# EAGLE design BinaryClockDisplay (EAGLE 9.3.2)
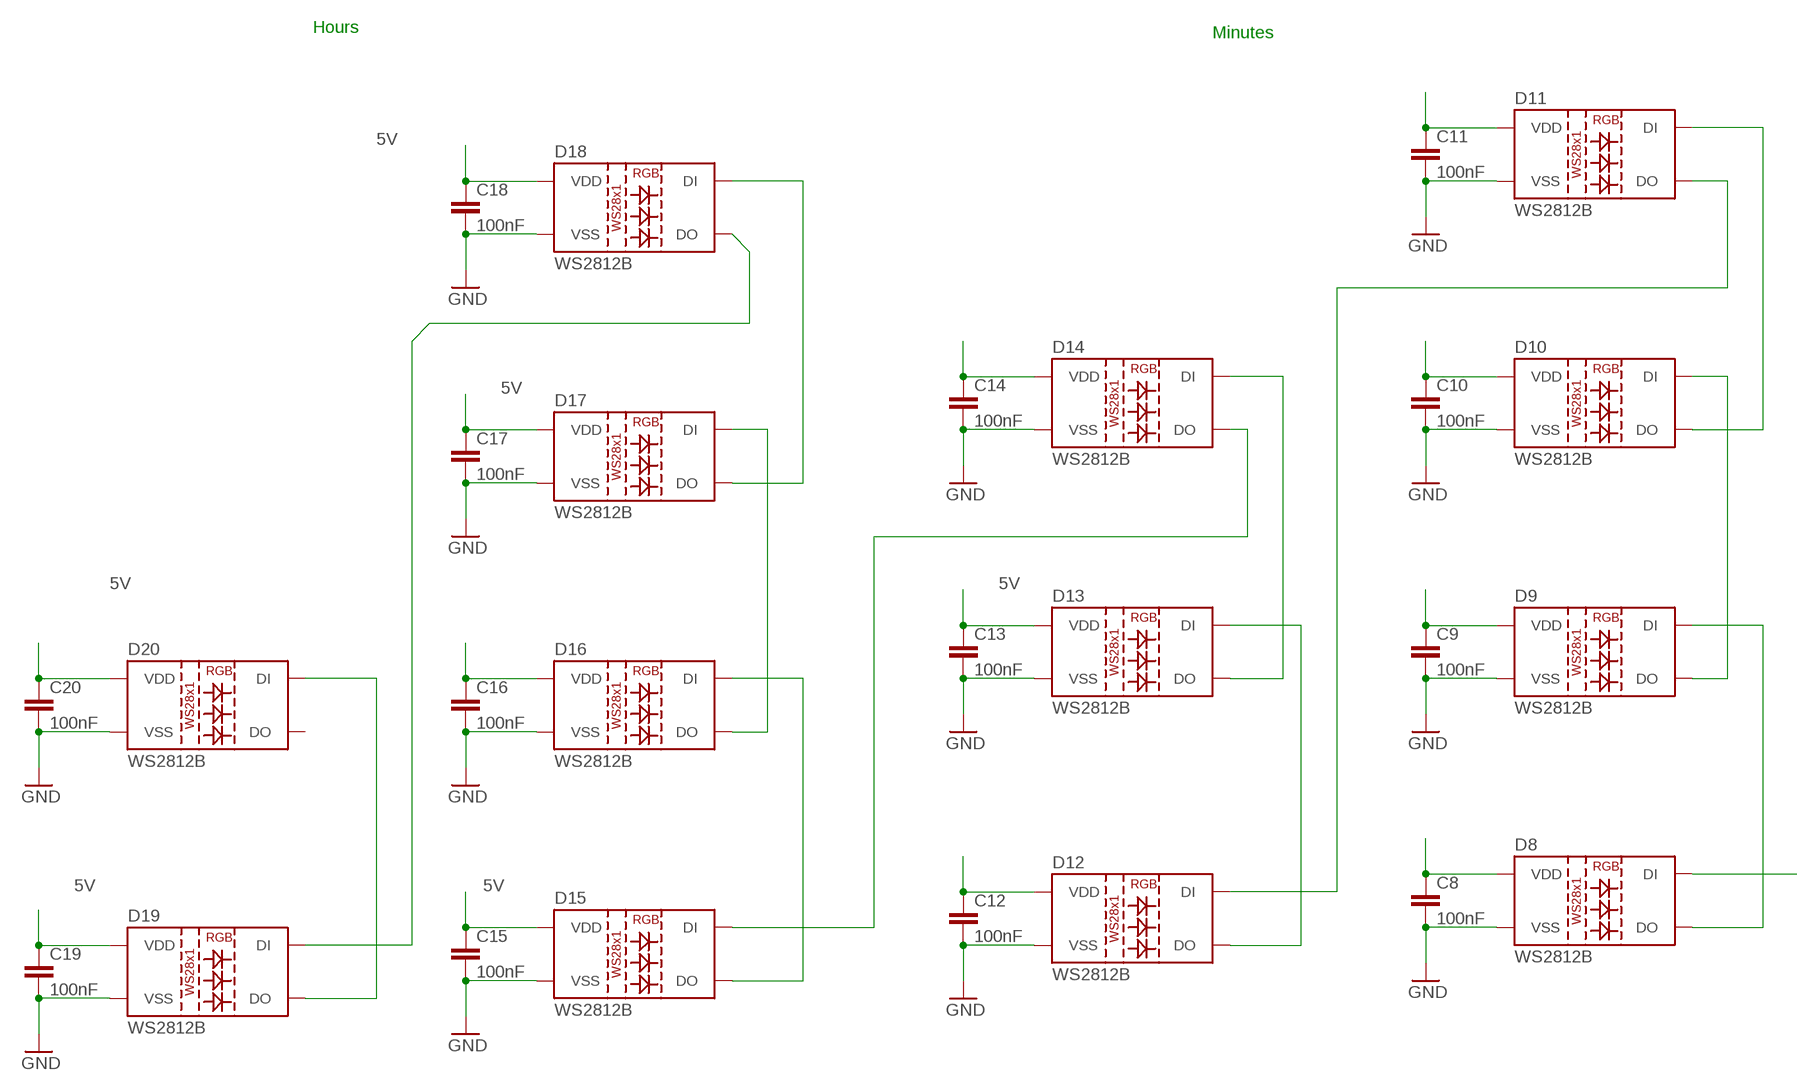
[diagram p0: schematic, sheet 1, part 1 of 2]
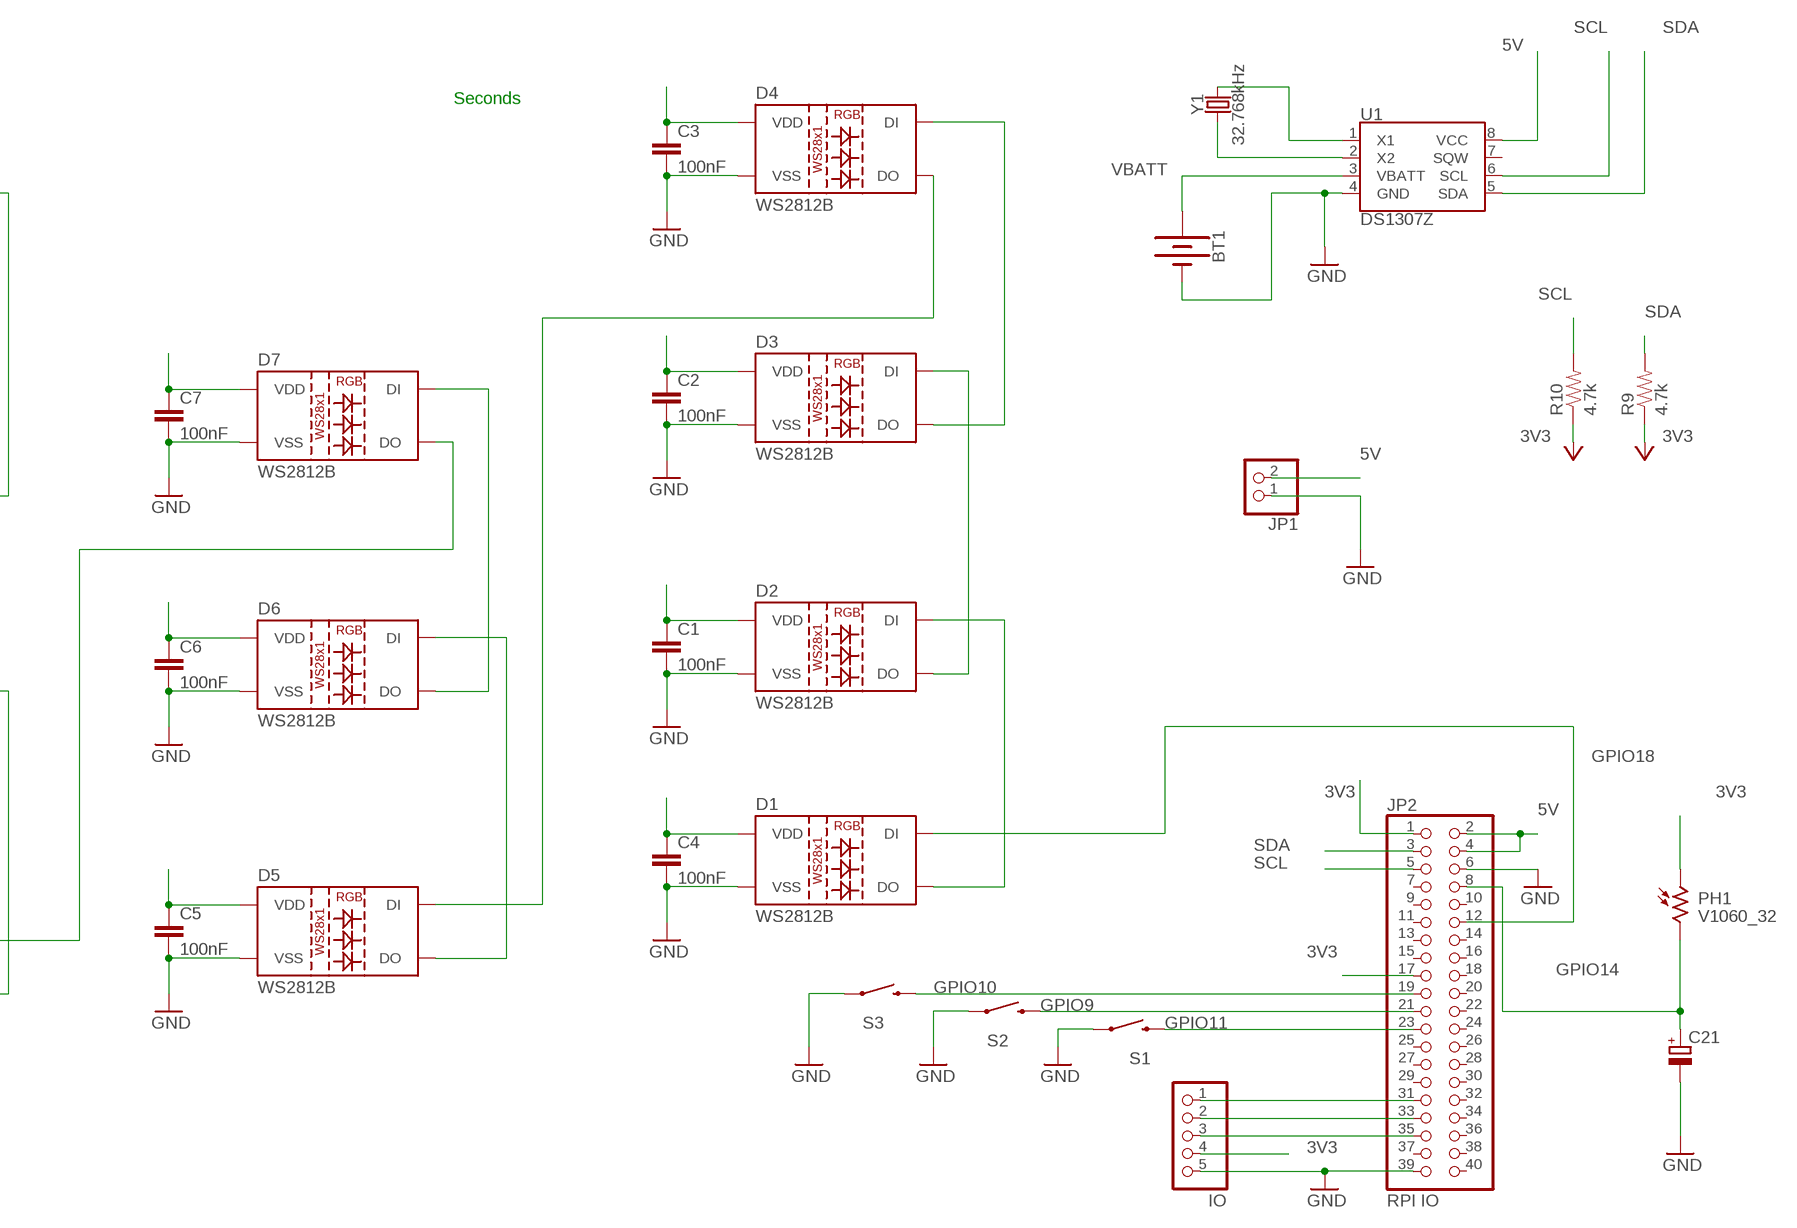
[diagram p1: schematic, sheet 1, part 2 of 2]

## Parts
BT1  BATTERY-20MM_PTH  [BATTCOM_20MM_PTH]
C1  100nF  CAP0805  [0805]
C2  100nF  CAP0805  [0805]
C3  100nF  CAP0805  [0805]
C4  100nF  CAP0805  [0805]
C5  100nF  CAP0805  [0805]
C6  100nF  CAP0805  [0805]
C7  100nF  CAP0805  [0805]
C8  100nF  CAP0805  [0805]
C9  100nF  CAP0805  [0805]
C10  100nF  CAP0805  [0805]
C11  100nF  CAP0805  [0805]
C12  100nF  CAP0805  [0805]
C13  100nF  CAP0805  [0805]
C14  100nF  CAP0805  [0805]
C15  100nF  CAP0805  [0805]
C16  100nF  CAP0805  [0805]
C17  100nF  CAP0805  [0805]
C18  100nF  CAP0805  [0805]
C19  100nF  CAP0805  [0805]
C20  100nF  CAP0805  [0805]
C21  CPOL-EUE5-10.5  [E5-10,5]
D1  WS2812B  [WS2812B]
D2  WS2812B  [WS2812B]
D3  WS2812B  [WS2812B]
D4  WS2812B  [WS2812B]
D5  WS2812B  [WS2812B]
D6  WS2812B  [WS2812B]
D7  WS2812B  [WS2812B]
D8  WS2812B  [WS2812B]
D9  WS2812B  [WS2812B]
D10  WS2812B  [WS2812B]
D11  WS2812B  [WS2812B]
D12  WS2812B  [WS2812B]
D13  WS2812B  [WS2812B]
D14  WS2812B  [WS2812B]
D15  WS2812B  [WS2812B]
D16  WS2812B  [WS2812B]
D17  WS2812B  [WS2812B]
D18  WS2812B  [WS2812B]
D19  WS2812B  [WS2812B]
D20  WS2812B  [WS2812B]
JP1  PINHD-1X2  [1X02]
JP2  RPI IO  PINHD-2X20  [2X20]
JP4  IO  PINHD-1X5  [1X05]
PH1  V1060_32  [TO-5_V10]
R9  4.7k  RESISTOR0805-RES  [0805]
R10  4.7k  RESISTOR0805-RES  [0805]
S1  SWITCH  SWITCH-MOMENTARY-2SMD-1101NE  [TACTILE-SWITCH-1101NE]
S2  SWITCH  SWITCH-MOMENTARY-2SMD-1101NE  [TACTILE-SWITCH-1101NE]
S3  SWITCH  SWITCH-MOMENTARY-2SMD-1101NE  [TACTILE-SWITCH-1101NE]
U1  DS1307Z  [SO08-0.15]
Y1  32.768kHz  CRYSTAL-32.768KHZPTH-2X6  [CRYSTAL-PTH-2X6-CYL]

## Nets
3V3: JP2.1 JP2.17 JP4.4 PH1.1 R9.1 R10.1 ; supply symbol labelled +3V3
5V: C1.1 C2.1 C3.1 C4.1 C5.1 C6.1 C7.1 C8.1 C9.1 C10.1 C11.1 C12.1 C13.1 C14.1 C15.1 C16.1 C17.1 C18.1 C19.1 C20.1 D1.1(VDD) D2.1(VDD) D3.1(VDD) D4.1(VDD) D5.1(VDD) D6.1(VDD) D7.1(VDD) D8.1(VDD) D9.1(VDD) D10.1(VDD) D11.1(VDD) D12.1(VDD) D13.1(VDD) D14.1(VDD) D15.1(VDD) D16.1(VDD) D17.1(VDD) D18.1(VDD) D19.1(VDD) D20.1(VDD) JP1.2 JP2.2 JP2.4 U1.8(VCC)
GND: BT1.2(-) C1.2 C2.2 C3.2 C4.2 C5.2 C6.2 C7.2 C8.2 C9.2 C10.2 C11.2 C12.2 C13.2 C14.2 C15.2 C16.2 C17.2 C18.2 C19.2 C20.2 C21.- D1.3(VSS) D2.3(VSS) D3.3(VSS) D4.3(VSS) D5.3(VSS) D6.3(VSS) D7.3(VSS) D8.3(VSS) D9.3(VSS) D10.3(VSS) D11.3(VSS) D12.3(VSS) D13.3(VSS) D14.3(VSS) D15.3(VSS) D16.3(VSS) D17.3(VSS) D18.3(VSS) D19.3(VSS) D20.3(VSS) JP1.1 JP2.6 JP2.39 JP4.5 S1.1 S2.1 S3.1 U1.4(GND)
GPIO6: JP2.31 JP4.1
GPIO9: JP2.21 S2.2
GPIO10: JP2.19 S3.2
GPIO11: JP2.23 S1.2
GPIO13: JP2.33 JP4.2
GPIO14: C21.+ JP2.8 PH1.2
GPIO18: D1.4(DI) JP2.12
GPIO19: JP2.35 JP4.3
N$1: D4.2(DO) D5.4(DI)
N$5: D5.2(DO) D6.4(DI)
N$6: D1.2(DO) D2.4(DI)
N$7: D2.2(DO) D3.4(DI)
N$8: D3.2(DO) D4.4(DI)
N$9: U1.1(X1) Y1.2
N$10: D6.2(DO) D7.4(DI)
N$11: D8.2(DO) D9.4(DI)
N$12: D9.2(DO) D10.4(DI)
N$13: D10.2(DO) D11.4(DI)
N$14: D11.2(DO) D12.4(DI)
N$15: D7.2(DO) D8.4(DI)
N$16: D12.2(DO) D13.4(DI)
N$17: D13.2(DO) D14.4(DI)
N$18: D15.2(DO) D16.4(DI)
N$19: D16.2(DO) D17.4(DI)
N$20: D17.2(DO) D18.4(DI)
N$21: D14.2(DO) D15.4(DI)
N$22: U1.2(X2) Y1.1
N$23: D19.2(DO) D20.4(DI)
N$26: D18.2(DO) D19.4(DI)
SCL: JP2.5 R10.2 U1.6(SCL)
SDA: JP2.3 R9.2 U1.5(SDA)
VBATT: BT1.1(+) U1.3(VBATT)
Unconnected: D20.2(DO) JP2.7 JP2.9 JP2.10 JP2.11 JP2.13 JP2.14 JP2.15 JP2.16 JP2.18 JP2.20 JP2.22 JP2.24 JP2.25 JP2.26 JP2.27 JP2.28 JP2.29 JP2.30 JP2.32 JP2.34 JP2.36 JP2.37 JP2.38 JP2.40 U1.7(SQW)

## Notes on the sheet
- Hours
- Minutes | Seconds

## Library data of the parts
BT1 = SparkFun-Batteries:BATTERY: Battery - Single Cell A variety of battery chemistries, sizes, and footprints. Device List: 20MM_PTH - Coin Cell Battery Holder - 20mm (PTH) <https://www.sparkfun.com/products/783> 6.8MM_PTH - Coin Cell Battery Holder - 6.8MM(SMD) <https://www.digikey.com/product-detail/en/seiko-instruments/MS621FE-FL11E/728-1057-ND/1889208?WT.srch=1&gclid=CNOQ5a6LzdQCFZS2wAodXCkE0g> 12MM_SMD - Coin Cell Battery Holder - 12mm (SMD) <https://www.sparkfun.com/products/10592> 12MM_PTH - Coin Cell Battery Holder - 12mm (PTH) <https://www.sparkfun.com/products/7948> 20MM_SMD - 20mm Coin Cell Battery Holder (SMD) (2 legs) Used on the Big Time Watch Kit <https://www.sparkfun.com/products/11734> 20MM_SMD_4LEGS - Coin Cell Battery Holder - 20mm (SMD) <https://www.sparkfun.com/products/11892> 20MM_SMD_4LEGS_OVERPASTE - Coin Cell Battery Holder - 20mm (SMD) <https://www.sparkfun.com/products/11892> (Over-paste on the legs) 24.5MM_PTH - Coin Cell Battery Holder - 24.5mm (PTH) <https://www.sparkfun.com/products/8863> 9V - 9V Battery Holder - PC Mount Used on the SparkFun SparkPunk Sound Kit <https://www.sparkfun.com/products/11177> and SparkFun SparkPunk Sequencer Kit <https://www.sparkfun.com/products/12707> 18650 - Battery Holder - 18650 (PTH) <https://www.sparkfun.com/products/13113> AA - Battery Holder - 1xAA (PTH) <https://www.sparkfun.com/products/7949> AAA - Battery Holder - 1xAAA (PTH) <https://www.sparkfun.com/products/12718> AA_KIT - Battery Holder - 1xAA (PTH) <https://www.sparkfun.com/products/7949> Special kit package - pads only have exposed copper on one side of the board. AAA_KIT - Battery Holder - 1xAAA (PTH) <https://www.sparkfun.com/products/12718> Special kit package - pads only have exposed copper on one side of the board.; PROD_ID: BATT-09031; SF_SKU: PRT-00783
C1-C20 = SparkFun-Passives:CAP: Capacitor Standard 0603 ceramic capacitor, and 0.1" leaded capacitor.
C21 = rcl:CPOL-EU: POLARIZED CAPACITOR, European symbol; SPICEPREFIX: C
D1-D20 = SparkFun-LED:WS2812B: WS2812B SMD addressable RGB LED 5x5mm SMD LED with built-in controller IC. Color: Red/Green/Blue mC Rating: RGB: 390, 660, 180 mcd Forward Voltage: RGB: 2.0, 3.0, 3.0 V Packages:WS2812B SparkFun Products: Blynk Board - ESP8266 <https://www.sparkfun.com/products/13794>; PROD_ID: DIO-12503
JP1 = pinhead:PINHD-1X2: PIN HEADER
JP2 = pinhead:PINHD-2X20: PIN HEADER
JP4 = pinhead:PINHD-1X5: PIN HEADER
PH1 = photo-elements:?1060*: Sensor Street Light control Source: http://optoelectronics.perkinelmer.com/content/Datasheets/DTS_PhotocellsB1060.pdf
R9 R10 = SparkFun-Resistors:RESISTOR: Resistor Basic schematic elements and footprints for 0603, 1206, and PTH resistors.
S1-S3 = SparkFun-Electromechanical:SWITCH-MOMENTARY-2: Various NO switches- pushbuttons, reed, etc; PROD_ID: SWCH-00815
U1 = SparkFun-Clocks:DS1307: Maxim DS1307 - I2C Real-time clock (RTC) The DS1307 serial real-time clock (RTC) is a low-power, full binary-coded decimal (BCD) clock/calendar plus 56 bytes of NV SRAM. Address and data are transferred serially through an I2C, bidirectional bus. The clock/calendar provides seconds, minutes, hours, day, date, month, and year information. SparkFun Products: Real Time Clock Module <https://www.sparkfun.com/products/12708> (BOB-12708) Datasheet <https://cdn.sparkfun.com/datasheets/BreakoutBoards/DS1307.pdf>; PROD_ID: IC-08138
Y1 = SparkFun-Clocks:CRYSTAL-32.768KHZ: 32.768kHz Crystal Frequency: 32.768kHz Frequency Stability: ±20ppm Load Capacitance: 12.5pF (PTH-2X6 & SMD-3.2X1.5), 6pF (SMD-2X6) SparkFun Products: SparkFun BigTime Watch Kit <https://www.sparkfun.com/products/11734> SparkFun nRF52832 Breakout <https://www.sparkfun.com/products/13990> SparkFun Real Time Clock Module <https://www.sparkfun.com/products/12708>; PROD_ID: XTAL-10112

## Board
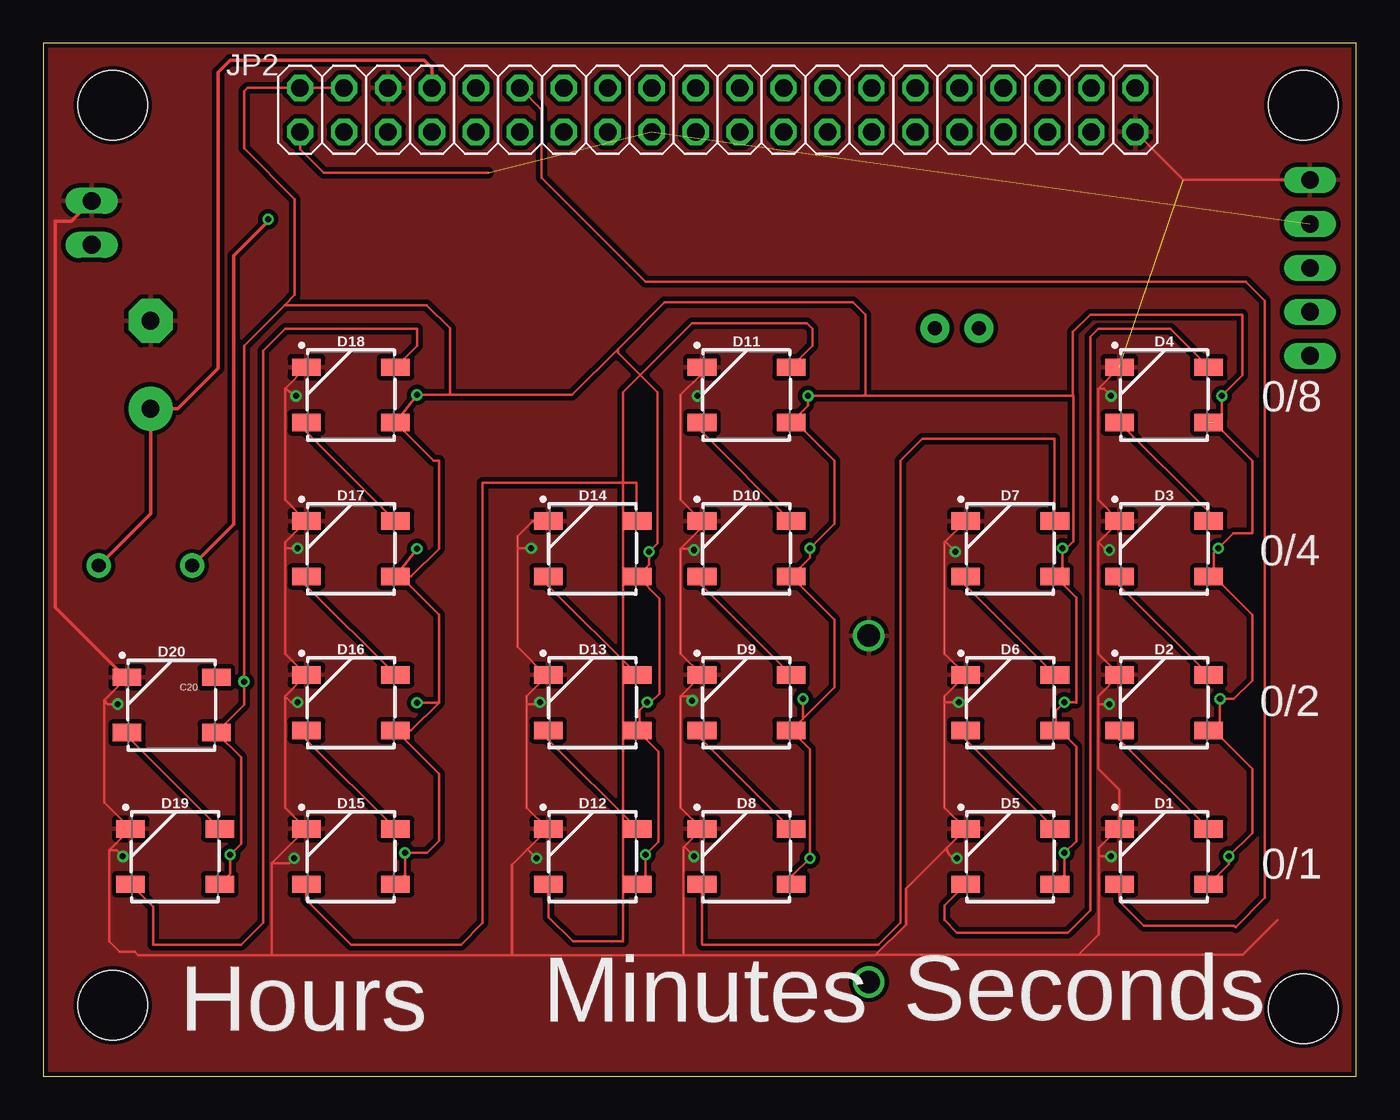
[diagram p2: board, top side]
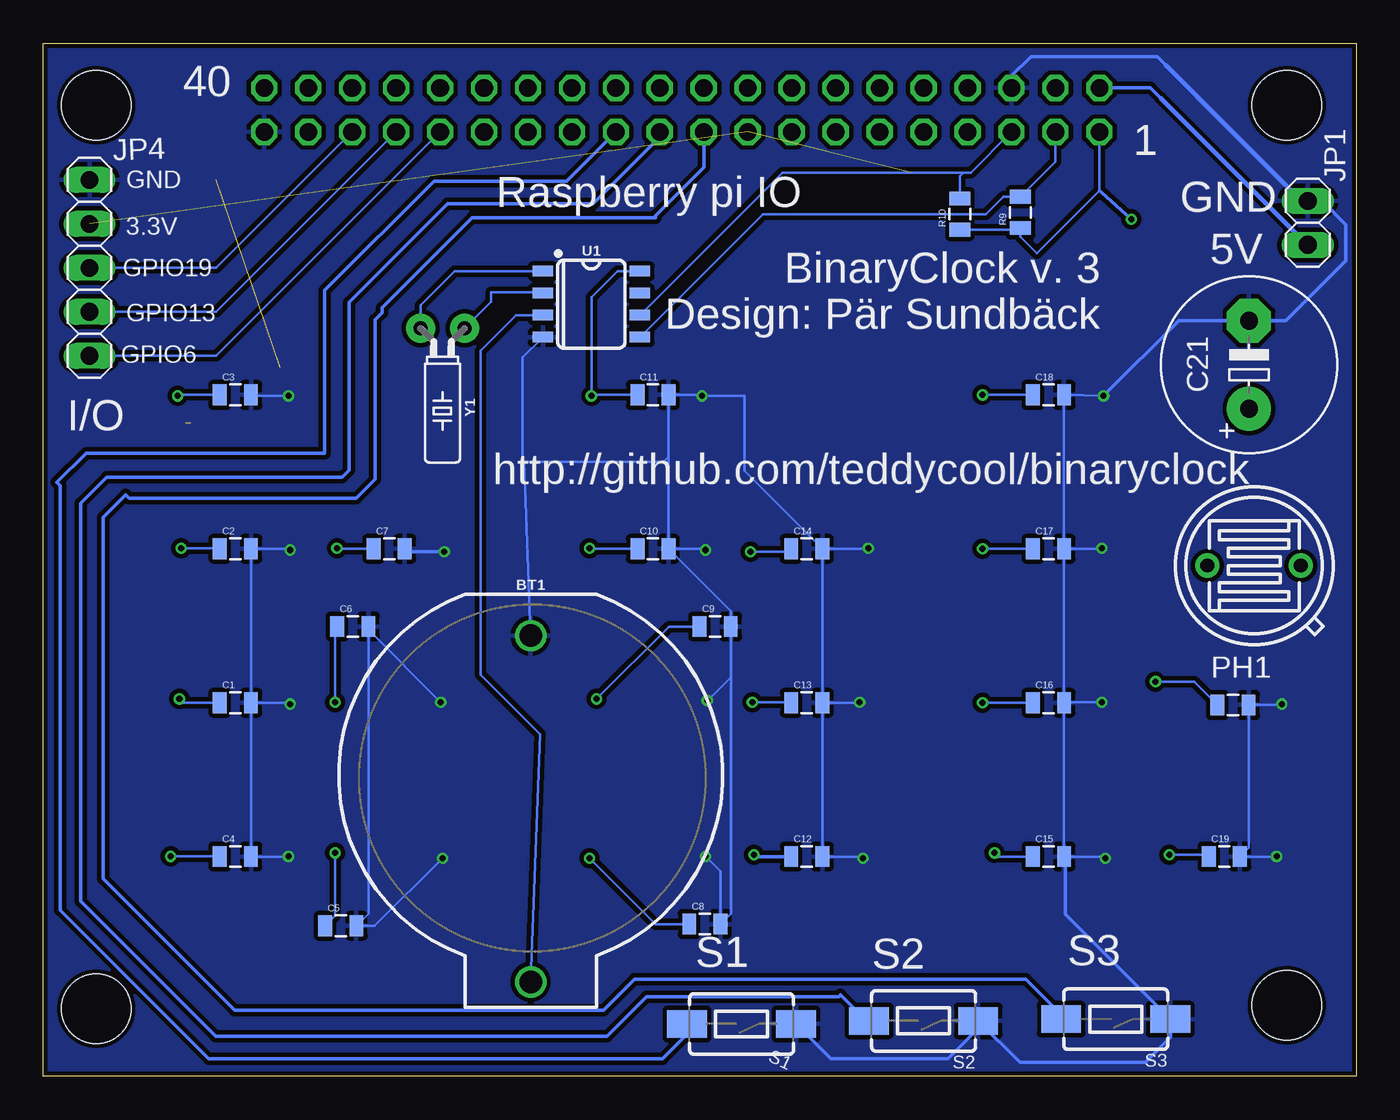
[diagram p3: board, bottom side, seen from below]

Size 75.87 x 59.68 mm. Coordinates in mm from the lower left corner, seen from the top.
Outline: 0,0 75.87,0 75.87,59.68 0,59.68 0,0
Copper layers (1*16): Top 0.035mm / dielectric 1.5mm / Bottom 0.035mm
Design rules "aisler_2_layer": minimum track width 0.1mm, minimum drill 0.2mm, track to track 0.1mm, track to pad 0.1mm, pad to pad 0.1mm, via to via 0.1mm, smd to smd 0.1mm, copper to edge 0.2mm, drill to drill 0.21mm, minimum pad ring 0.25mm, minimum via ring 0.15mm, stop-mask expansion 0mil, vias tented up to drill 0mil, thermal gap 10mil
Holes 4 mm at 4,56.11 72.8,56.11 4,4.11 72.8,3.91

### Footprints (pad centres in the part's own frame; a part is rotated, then mirrored left to right if it is on the bottom)
BATTCOM_20MM_PTH = drill 1.3: 1 11.85,0; 2 -8.15,0
0805 = smd 0.8 x 1.2: 1 -0.9,0; 2 0.9,0
E5-10,5 = drill 1.016 pad 2.54: + -2.54,0 | drill 1.016 pad 2.54 octagon: - 2.54,0
WS2812B = smd 1.651 x 1: 1 2.577,-1.6; 2 2.577,1.6; 3 -2.577,1.6; 4 -2.577,-1.6
1X02 = drill 1.016 long: 1 -1.27,0; 2 1.27,0
2X20 = drill 1.016 octagon: 1 -24.13,-1.27; 2 -24.13,1.27; 3 -21.59,-1.27; 4 -21.59,1.27; 5 -19.05,-1.27; 6 -19.05,1.27; 7 -16.51,-1.27; 8 -16.51,1.27; 9 -13.97,-1.27; 10 -13.97,1.27; 11 -11.43,-1.27; 12 -11.43,1.27; 13 -8.89,-1.27; 14 -8.89,1.27; 15 -6.35,-1.27; 16 -6.35,1.27; 17 -3.81,-1.27; 18 -3.81,1.27; 19 -1.27,-1.27; 20 -1.27,1.27; 21 1.27,-1.27; 22 1.27,1.27; 23 3.81,-1.27; 24 3.81,1.27; 25 6.35,-1.27; 26 6.35,1.27; 27 8.89,-1.27; 28 8.89,1.27; 29 11.43,-1.27; 30 11.43,1.27; 31 13.97,-1.27; 32 13.97,1.27; 33 16.51,-1.27; 34 16.51,1.27; 35 19.05,-1.27; 36 19.05,1.27; 37 21.59,-1.27; 38 21.59,1.27; 39 24.13,-1.27; 40 24.13,1.27
1X05 = drill 1.016 long: 1 -5.08,0; 2 -2.54,0; 3 0,0; 4 2.54,0; 5 5.08,0
TO-5_V10 = drill 0.8 pad 1.4: 1 -2.7,0; 2 2.7,0
TACTILE-SWITCH-1101NE = smd 2.3 x 1.6: 1 -3.15,0; 2 3.15,0
SO08-0.15 = smd 0.6 x 1.2: 1 -1.905,-2.8; 2 -0.635,-2.8; 3 0.635,-2.8; 4 1.905,-2.8; 5 1.905,2.8; 6 0.635,2.8; 7 -0.635,2.8; 8 -1.905,2.8
CRYSTAL-PTH-2X6-CYL = drill 0.813 pad 1.676: 1 -1.27,0; 2 1.27,0

### Placement (x,y rotation side)
BT1  47.7,17.31 270 bottom
C1  64.77,21.59 0 bottom
C2  64.77,30.48 0 bottom
C3  64.77,39.37 0 bottom
C4  64.77,12.7 0 bottom
C5  58.68,8.7 0 bottom
C6  57.98,25.99 0 bottom
C7  55.88,30.48 0 bottom
C8  37.64,8.8 0 bottom
C9  37.04,25.99 0 bottom
C10  40.64,30.48 0 bottom
C11  40.64,39.37 0 bottom
C12  31.75,12.7 0 bottom
C13  31.75,21.59 0 bottom
C14  31.75,30.48 0 bottom
C15  17.78,12.7 0 bottom
C16  17.78,21.59 0 bottom
C17  17.78,30.48 0 bottom
C18  17.78,39.37 0 bottom
C19  7.62,12.7 0 bottom
C20  7.12,21.46 0 bottom
C21  6.2,41.11 90 bottom
D1  64.77,12.7 0 top
D2  64.77,21.59 0 top
D3  64.77,30.48 0 top
D4  64.77,39.37 0 top
D5  55.88,12.7 0 top
D6  55.88,21.59 0 top
D7  55.88,30.48 0 top
D8  40.64,12.7 0 top
D9  40.64,21.59 0 top
D10  40.64,30.48 0 top
D11  40.64,39.37 0 top
D12  31.75,12.7 0 top
D13  31.75,21.59 0 top
D14  31.75,30.48 0 top
D15  17.78,12.7 0 top
D16  17.78,21.59 0 top
D17  17.78,30.48 0 top
D18  17.78,39.37 0 top
D19  7.62,12.7 0 top
D20  7.42,21.46 0 top
JP1  2.8,49.31 270 bottom
JP2  38.97,55.83 0 top
JP4  73.2,46.71 90 bottom
PH1  5.9,29.51 0 bottom
R9  19.4,49.91 90 bottom
R10  22.9,49.81 90 bottom
S1  35.52,3.03 180 bottom
S2  25,3.21 180 bottom
S3  13.9,3.31 180 bottom
U1  44.2,44.61 270 bottom
Y1  52.8,43.21 180 bottom

### Tracks (layer width: path | path; a pad name or v marks a point on that pad's centre or on a via)
3V3  (via drill 0.35)  (2 unrouted)
  Top 0.152: 25.7,52.21 16.2,52.21 14.84,53.57 JP2.1
  Top 0.2: PH1.1 11,31.91 11,47.41 13,49.41 v13,49.51
  Bottom 0.152: 14.84,51.17 18.45,47.56 19.4,48.51 R9.1 19.5,48.91 R10.1 | JP2.1 14.84,51.18 14.74,51.08
  Bottom 0.2: 14.84,51.17 14.74,51.08 v13,49.51
5V  (via drill 0.35)  (1 unrouted)
  Top 0.152: 67.64,28.88 69.85,26.67 69.85,22.86 68.8,21.81 v68,21.81 68,20.31 | 67.64,28.88 D3.1 | 67.75,37.66 69.85,35.56 69.85,31.38 68.77,31.38 v67.9,30.51 67.64,30.25 67.64,28.88 | 67.75,37.66 67.64,37.77 | 43.9,20.67 45.72,22.49 45.72,26.38 D10.1 44.3,29.96 v44.3,30.51 45.72,31.93 45.72,35.56 43.51,37.77 D11.1 44.2,38.75 v44.2,39.31 47.4,39.31 | D13.1 34.45,19.86 | 34.45,19.86 35.56,18.76 35.56,13.57 v34.8,12.81 34.8,11.57 D12.1 | 22.86,21.59 21.26,19.99 D16.1 22.86,17.49 22.86,13.6 22.17,12.91 v20.9,12.91 20.9,11.64 D15.1 | 22.86,21.59 22.86,26.67 20.65,28.88 D17.1 | D17.1 21.26,28.88 22.86,30.48 22.86,35.56 22.57,35.56 D18.1 v21.59,39.37 23.5,39.37 | D17.1 v21.59,30.48 | 22.86,21.59 v21.59,21.59 | 58.9,30.31 58.9,29.32 D7.1 59.69,27.65 59.69,21.59 59.67,21.61 v59,21.61 58.5,21.11 58.5,19.99 | 58.9,30.31 v58.9,30.51 | D1.1 68.5,12.25 v68.5,12.71 69.85,14.06 69.85,17.78 67.76,19.87 68,20.11 68,20.31 | D5.1 59,11.64 v59,12.91 59.69,13.6 59.69,19.05 58.75,19.99 58.5,19.99 | D19.1 10.8,11.7 v10.8,12.81 11.43,13.44 11.43,18.43 D20.1 11.6,21.46 v11.6,22.81 11.6,42.21 13.95,44.56 | 67.75,37.66 68.1,38.01 v68.1,39.31 69.3,40.51 69.3,44.01 60.5,44.01 59.5,43.01 59.5,39.31 | 58.9,30.31 59.51,30.92 59.51,39.31 59.5,39.31 | 59.5,39.31 47.4,39.31 | 23.5,39.37 30.56,39.37 33.2,42.01 | 33.2,42.01 35.9,44.71 46.8,44.71 47.5,44.01 47.5,39.41 47.4,39.31 | 33.2,42.01 33.2,41.81 35.5,39.51 35.5,30.81 v35,30.31 35,29.55 D14.1 35.6,27.61 35.6,22.11 35.1,21.61 v34.9,21.61 34.45,21.16 34.45,19.86 | 23.5,39.37 23.5,43.21 22.15,44.56 13.95,44.56 | D9.1 | D9.1 43.9,20.67 | 43.9,20.67 v43.9,21.81
  Top 0.152: 13.95,44.56 14.54,45.15 14.54,50.67 11.6,53.61 11.6,56.91 11.8,57.11 11.81,57.1 JP2.2 JP2.4 | D2.1 67.68,19.99 68,20.31 | 58.5,19.99 D6.1 | D9.1 44.3,18.91 v44.3,12.61 43.3,11.61 arc90 43.22,11.53 D8.1
  Bottom 0.152: C18.1 v21.59,39.37 | v21.59,21.59 C16.1 | C17.1 v21.59,30.48 | C3.1 68.04,39.37 v68.1,39.31 | C2.1 65.7,30.51 v67.9,30.51 | C4.1 v68.5,12.71 | C5.1 59,9.28 v59,12.91 | C1.1 67.78,21.59 v68,21.81 | v59,21.61 59,25.87 C6.1 | C7.1 58.87,30.48 v58.9,30.51 | v44.3,12.61 40.49,8.8 C8.1 | C15.1 20.69,12.7 v20.9,12.91 | C19.1 8.63,12.81 v10.8,12.81 | C14.1 32.82,30.31 v35,30.31 | C10.1 44.27,30.48 v44.3,30.51 | C11.1 44.14,39.37 v44.2,39.31 44.2,45.01 42.7,46.52 U1.8 | C20.1 9.37,22.81 v11.6,22.81 | C13.1 32.67,21.61 v34.9,21.61 | v43.9,21.81 39.72,25.99 C9.1
  Bottom 0.2: JP2.2 11.89,57.1 11.3,56.51 | v34.8,12.81 34.69,12.7 C12.1
  Bottom 0.254: 11.3,56.51 2.83,48.04 JP1.2
GND  (via drill 0.35)  (1 unrouted)
  Top 0.152: D1.3 62.19,14.41 | 62.19,14.41 62.19,16.55 60.96,17.78 60.96,21.51 | 60.96,21.51 60.96,21.96 D2.3 60.96,24.42 60.96,30.85 | 60.96,30.85 D3.3 60.96,33.31 60.96,39.74 | 60.96,39.74 D4.3 | 36.83,21.96 D9.3 36.83,24.42 36.83,30.48 | 36.83,21.96 36.83,15.53 D8.3 37,13.24 | 36.83,30.48 38.1,31.75 38.06,31.79 D10.3 36.83,33.31 36.83,39.37 38.06,40.6 D11.3 38.06,39.57 v37.8,39.31 | 52.07,21.61 52.07,15.53 D5.3 52.21,13.2 | 52.07,21.61 52.07,21.96 D6.3 52.07,24.42 52.07,30.85 | 52.07,30.85 D7.3 | 29.1,23.11 27.94,21.96 27.94,21.51 | 29.1,23.11 D13.3 | 27.94,21.51 27.94,15.53 D12.3 27.99,13.12 | D14.3 28.27,32.08 27.4,31.21 27.4,30.41 | D15.3 | D15.3 13.97,15.53 13.97,21.96 | 13.97,21.96 D16.3 13.97,24.42 13.97,30.41 | 13.97,30.41 13.97,30.85 D17.3 13.97,33.31 13.97,39.74 | 13.97,39.74 D18.3 | 3.51,21.73 4.8,23.01 D20.3 | 3.51,21.73 3.51,15.83 D19.3 3.8,13.06 | 3.8,13.06 3.8,7.81 4.41,7.2 5.28,7.2 5.47,7.01 13.2,7.01 | 13.2,7.01 13.2,12.31 | 13.2,12.31 D15.3 | 13.2,7.01 27.1,7.01 | 27.1,7.01 27.1,12.23 27.99,13.12 | 52.21,13.2 49.84,10.83 49.84,8.76 48.09,7.02 | 48.09,7.02 48.08,7.01 37,7.01 | 27.1,7.01 37,7.01 | 48.09,7.02 59.81,7.02 | 59.81,7.02 61,8.21 61,12.71 | 62.19,14.41 61,13.22 61,12.71 | 37,13.24 37,7.01 | 59.81,7.02 69.31,7.02 71.3,9.01 | 13.97,39.74 v14.6,39.31 | 3.51,21.73 3.73,21.51 v4.3,21.51 | 3.8,13.06 4.25,13.06 v4.6,12.71 | 13.2,12.31 14.2,12.31 v14.5,12.61 | 13.97,21.96 14.32,21.61 v14.7,21.61 | 13.97,30.41 14.07,30.51 v14.7,30.51 | 27.94,21.51 28.6,21.51 v28.7,21.61 | 29.1,23.11 27.4,24.81 27.4,30.41 | v28.2,30.51 27.5,30.51 27.4,30.41 | v28.5,12.61 27.99,13.12 | 37,13.24 37.07,13.24 v37.6,12.71 | 36.83,21.96 37.25,21.96 v37.5,21.71
  Top 0.152: 36.83,30.48 37.53,30.48 v37.6,30.41 | 60.96,39.74 61.27,39.74 v61.7,39.31 | 60.96,30.85 61.4,30.41 v61.6,30.41 | 52.07,30.85 52.16,30.85 v52.7,30.31 | 52.07,21.61 v52.9,21.61 | 52.21,13.2 arc90 v52.8,12.61 | 61,12.71 v61.7,12.71 | 60.96,21.51 v61.6,21.51 | JP4.5 65.87,51.79 JP2.39
  Top 0.2: JP1.1 1.63,49.41 0.7,49.41 0.7,27.11 4.8,23.01
  Bottom 0.152: C1.2 C2.2 61.67,30.48 v61.6,30.41 | C1.2 C4.2 v61.71,12.7 arc-90 v61.7,12.71 | 39.74,35.81 C11.2 37.86,39.37 v37.8,39.31 35.35,39.31 35.35,34.98 C14.2 | 39.74,35.81 C10.2 | C10.2 36.14,26.88 C9.2 | C9.2 36.14,9.4 C8.2 36.74,11.85 v37.6,12.71 | C14.2 C13.2 | C13.2 C12.2 28.59,12.7 v28.5,12.61 | C17.2 C18.2 v14.6,39.31 | C17.2 C16.2 | C16.2 C15.2 16.8,12.7 14.59,12.7 v14.5,12.61 | v4.3,21.51 4.35,21.46 C20.2 6.22,13.2 C19.2 v4.61,12.7 v4.6,12.71 | C16.2 16.86,21.61 v14.7,21.61 | C17.2 14.73,30.48 v14.7,30.51 | C14.2 28.23,30.48 v28.2,30.51 | C13.2 28.72,21.59 v28.7,21.61 | C9.2 36.14,23.07 v37.5,21.71 | C10.2 37.67,30.48 v37.6,30.41 | C3.2 63.81,39.31 v61.7,39.31 | v52.9,21.61 57.08,25.79 C6.2 57.08,9.4 C5.2 56.71,8.7 v52.8,12.61 | C1.2 61.68,21.59 arc90 v61.6,21.51 | BT1.2 48.08,35.51 | U1.4 48.17,41.53 48.17,35.51 48.08,35.51 | 39.74,35.81 40.04,35.51 48.08,35.51
  Bottom 0.2: 3,50.58 1.97,50.58 0.6,49.21 0.6,47.11 4.06,43.65 C21.- 10.26,43.65 v14.6,39.31 | 11,58.41 11.5,58.91 18.8,58.91 19.92,57.79 JP2.6 | S1.1 30.35,1.01 23.6,1.01 21.85,2.76 S2.1 19.45,0.81 12.2,0.81 10.75,2.26 S3.1 16.8,9.36 16.8,12.7 | v52.7,30.31 54.81,30.31 C7.2
  Bottom 0.254: 11,58.41 3.17,50.58 3,50.58 JP1.1
  pour Top (isolate 0.254): 0.1,59.51 0.1,0.01 76,0.01 76,59.51
  pour Bottom (isolate 0.254): 75.8,59.61 75.8,0.21 -0.1,0.21 -0.1,59.61
GPIO6
  Bottom 0.152: JP2.31 65.87,41.63 JP4.1
GPIO9
  Bottom 0.2: JP2.21 40.24,54.27 44.1,50.41 52.5,50.41 58.2,44.71 58.2,35.01 58.6,34.61 72.2,34.61 73.7,33.11 73.7,10.11 65.9,2.31 43.3,2.31 41,4.61 29.9,4.61 29.8,4.71 28.3,3.21 S2.2
GPIO10
  Bottom 0.2: JP2.19 37.7,52.51 40.5,49.71 40.5,49.61 51.1,49.61 56.3,44.41 56.3,44.11 56.7,43.71 56.7,34.51 57.8,33.41 70.9,33.41 71.1,33.61 72.4,32.31 72.4,11.41 64.8,3.81 43.5,3.81 41.7,5.61 19.1,5.61 17.05,3.56 S3.2
GPIO11
  Bottom 0.2: JP2.23 45.63,51.71 53.3,51.71 59.6,45.41 59.6,36.01 73.4,36.01 75.1,34.31 74.9,34.11 74.9,9.61 66.3,1.01 40.1,1.01 38.67,2.44 S1.2
GPIO13
  Bottom 0.152: JP2.33 65.87,44.17 JP4.2
GPIO14
  Top 0.2: JP2.8 22.46,58.25 22,58.71 10.8,58.71 10.1,58.01 10.1,40.91 7.76,38.57 C21.+ 6.2,32.51 PH1.2
GPIO18
  Top 0.152: D1.4 62.19,10.12 63.6,8.71 68.8,8.71 68.9,8.61 70.6,10.31 70.6,44.81 69.5,45.91 34.8,45.91 28.8,51.91 28.8,55.84 JP2.12
GPIO19
  Bottom 0.152: JP2.35 65.87,46.71 JP4.3
N$1
  Top 0.152: D4.2 65.14,43.18 60.96,43.18 60.5,42.72 60.5,9.61 59.2,8.31 52.8,8.31 52.07,9.04 52.07,9.87 D5.4
N$5
  Top 0.152: D5.2 53.3,19.45 D6.4
N$6
  Top 0.152: D1.2 62.19,19.45 D2.4
N$7
  Top 0.152: D2.2 62.19,28.34 D3.4
N$8
  Top 0.152: D3.2 67.35,32.62 D4.4
N$9
  Bottom 0.152: Y1.2 54.07,44.54 52.09,46.52 U1.1
N$10
  Top 0.152: D6.2 53.3,28.34 D7.4
N$11
  Top 0.152: D8.2 38.06,19.45 D9.4
N$12
  Top 0.152: D9.2 38.06,28.34 D10.4
N$13
  Top 0.152: D10.2 38.06,37.23 D11.4
N$14
  Top 0.152: D11.2 44.45,42.2 44.45,43.18 44.12,43.51 37.5,43.51 33.5,39.51 33.5,7.81 30.6,7.81 29.21,9.2 29.21,10.16 29.17,10.2 D12.4
N$15
  Top 0.152: D7.2 58.42,32.12 58.42,36.83 50.8,36.83 49.53,35.56 49.53,8.89 48.26,7.62 38.1,7.62 38.06,7.66 D8.4
N$16
  Top 0.152: D12.2 29.17,19.45 D13.4
N$17
  Top 0.152: D13.2 29.17,28.34 D14.4
N$18
  Top 0.152: D15.2 15.2,19.45 D16.4
N$19
  Top 0.152: D16.2 15.2,28.34 D17.4
N$20
  Top 0.152: D17.2 15.2,37.23 D18.4
N$21
  Top 0.152: D14.2 34.29,32.12 34.29,34.29 25.4,34.29 25.4,8.89 24.13,7.62 17.78,7.62 15.2,10.2 D15.4
N$22
  Bottom 0.152: Y1.1 50,44.74 50,45.31 47.06,45.31 U1.2
N$23
  Top 0.152: D19.2 4.84,19.65 D20.4
N$26
  Top 0.152: D18.2 21.59,42.2 21.59,43.18 13.97,43.18 12.7,41.91 12.7,8.89 11.43,7.62 6.35,7.62 6.35,9.79 D19.4
SCL
  Bottom 0.152: U1.6 33.16,52.21 22.7,52.21 | JP2.5 22.27,52.21 22.7,52.21 | 22.7,52.21 22.9,52.01 R10.2
SDA
  Bottom 0.152: U1.5 34.3,49.81 21.4,49.81 20.4,50.81 R9.2 17.38,52.83 JP2.3
VBATT
  Bottom 0.152: BT1.1 47.16,19.77 50.6,23.21 50.6,41.91 48.53,43.98 U1.3

### Text on the board
tNames: 0/8 | 0/4 | 0/2 | 0/1 | Hours | Minutes | Seconds
bNames: 40 | 1 | GND | GND | Raspberry pi IO | 5V | 3.3V | BinaryClock v. 3 / Design: Pär Sundbäck | GPIO19 | GPIO13 | GPIO6 | I/O | http://github.com/teddycool/binaryclock | S3 | S2 | S1